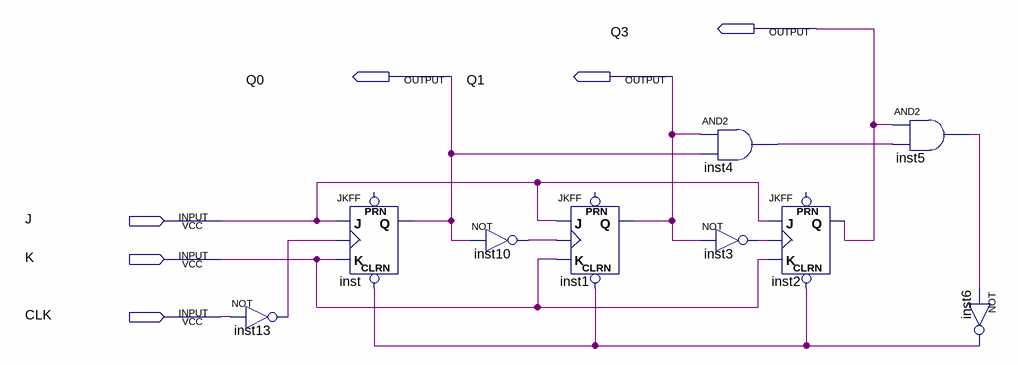
[diagram p0: schematic sheet]
// Quartus schematic conter.bdf as structural Verilog: 9 symbols, 6 pins
module conter (
  input  J,
  input  K,
  input  CLK,
  output Q3,
  output Q0,
  output Q1
);

  wire inst3_out, inst4_out, inst5_out, inst6_out, inst10_out, inst13_out;

  not inst13 (inst13_out, CLK);
  JKFF inst (.CLRN(inst6_out), .K(K), .J(J), .CLK(inst13_out), .Q(Q0));  // open: PRN
  not inst10 (inst10_out, Q0);
  JKFF inst1 (.CLRN(inst6_out), .K(K), .J(J), .CLK(inst10_out), .Q(Q1));  // open: PRN
  and inst4 (inst4_out, Q1, Q0);
  JKFF inst2 (.CLRN(inst6_out), .K(K), .J(J), .CLK(inst3_out), .Q(Q3));  // open: PRN
  not inst3 (inst3_out, Q1);
  and inst5 (inst5_out, Q3, inst4_out);
  not inst6 (inst6_out, inst5_out);
endmodule
